# Altium schematic sheet 18.SchDoc
size 297 x 209 mm
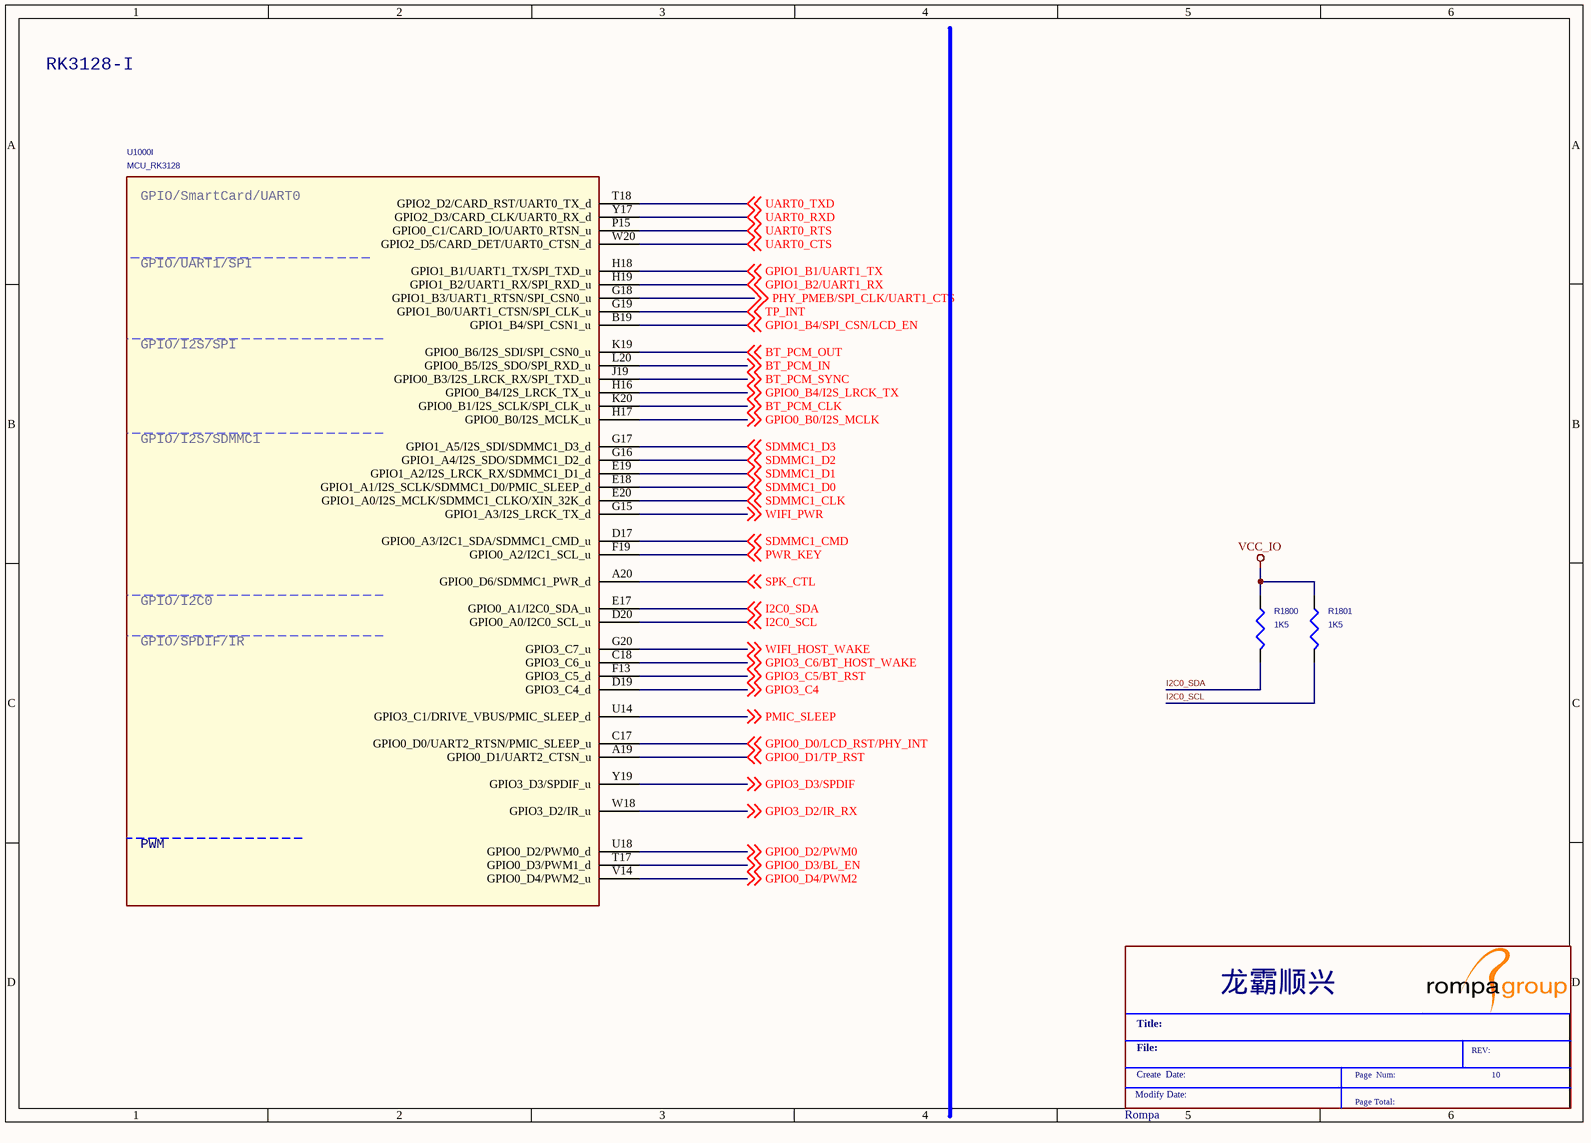
[diagram p0: 18.SchDoc]

## Parts
*  Rompa  Schematic Page Number: 10  (graphical)
R1800  1K5  [R0402]
R1801  1K5  [R0402]
U1000  MCU_RK3128  [BGA316-14X14-0.65]  (part I of 12)

## Nets
VCC_IO: R1800.1 R1801.1
BT_PCM_CLK: U1000.K20(GPIO0_B1/I2S_SCLK/SPI_CLK_u) ; off-sheet BT_PCM_CLK
BT_PCM_IN: U1000.L20(GPIO0_B5/I2S_SDO/SPI_RXD_u) ; off-sheet BT_PCM_IN
BT_PCM_OUT: U1000.K19(GPIO0_B6/I2S_SDI/SPI_CSN0_u) ; off-sheet BT_PCM_OUT
BT_PCM_SYNC: U1000.J19(GPIO0_B3/I2S_LRCK_RX/SPI_TXD_u) ; off-sheet BT_PCM_SYNC
GPIO0_B0/I2S_MCLK: U1000.H17(GPIO0_B0/I2S_MCLK_u) ; off-sheet GPIO0_B0/I2S_MCLK
GPIO0_B4/I2S_LRCK_TX: U1000.H16(GPIO0_B4/I2S_LRCK_TX_u) ; off-sheet GPIO0_B4/I2S_LRCK_TX
GPIO0_D0/LCD_RST/PHY_INT: U1000.C17(GPIO0_D0/UART2_RTSN/PMIC_SLEEP_u) ; off-sheet GPIO0_D0/LCD_RST/PHY_INT
GPIO0_D1/TP_RST: U1000.A19(GPIO0_D1/UART2_CTSN_u) ; off-sheet GPIO0_D1/TP_RST
GPIO0_D2/PWM0: U1000.U18(GPIO0_D2/PWM0_d) ; off-sheet GPIO0_D2/PWM0
GPIO0_D3/BL_EN: U1000.T17(GPIO0_D3/PWM1_d) ; off-sheet GPIO0_D3/BL_EN
GPIO0_D4/PWM2: U1000.V14(GPIO0_D4/PWM2_u) ; off-sheet GPIO0_D4/PWM2
GPIO1_B1/UART1_TX: U1000.H18(GPIO1_B1/UART1_TX/SPI_TXD_u) ; off-sheet GPIO1_B1/UART1_TX
GPIO1_B2/UART1_RX: U1000.H19(GPIO1_B2/UART1_RX/SPI_RXD_u) ; off-sheet GPIO1_B2/UART1_RX
GPIO1_B4/SPI_CSN/LCD_EN: U1000.B19(GPIO1_B4/SPI_CSN1_u) ; off-sheet GPIO1_B4/SPI_CSN/LCD_EN
GPIO3_C4: U1000.D19(GPIO3_C4_d) ; off-sheet GPIO3_C4
GPIO3_C5/BT_RST: U1000.F13(GPIO3_C5_d) ; off-sheet GPIO3_C5/BT_RST
GPIO3_C6/BT_HOST_WAKE: U1000.C18(GPIO3_C6_u) ; off-sheet GPIO3_C6/BT_HOST_WAKE
GPIO3_D2/IR_RX: U1000.W18(GPIO3_D2/IR_u) ; off-sheet GPIO3_D2/IR_RX
GPIO3_D3/SPDIF: U1000.Y19(GPIO3_D3/SPDIF_u) ; off-sheet GPIO3_D3/SPDIF
I2C0_SCL: R1801.2 U1000.D20(GPIO0_A0/I2C0_SCL_u) ; off-sheet I2C0_SCL
I2C0_SDA: R1800.2 U1000.E17(GPIO0_A1/I2C0_SDA_u) ; off-sheet I2C0_SDA
PHY_PMEB/SPI_CLK/UART1_CTS: U1000.G18(GPIO1_B3/UART1_RTSN/SPI_CSN0_u) ; off-sheet PHY_PMEB/SPI_CLK/UART1_CTS
PMIC_SLEEP: U1000.U14(GPIO3_C1/DRIVE_VBUS/PMIC_SLEEP_d) ; off-sheet PMIC_SLEEP
PWR_KEY: U1000.F19(GPIO0_A2/I2C1_SCL_u) ; off-sheet PWR_KEY
SDMMC1_CLK: U1000.E20(GPIO1_A0/I2S_MCLK/SDMMC1_CLKO/XIN_32K_d) ; off-sheet SDMMC1_CLK
SDMMC1_CMD: U1000.D17(GPIO0_A3/I2C1_SDA/SDMMC1_CMD_u) ; off-sheet SDMMC1_CMD
SDMMC1_D0: U1000.E18(GPIO1_A1/I2S_SCLK/SDMMC1_D0/PMIC_SLEEP_d) ; off-sheet SDMMC1_D0
SDMMC1_D1: U1000.E19(GPIO1_A2/I2S_LRCK_RX/SDMMC1_D1_d) ; off-sheet SDMMC1_D1
SDMMC1_D2: U1000.G16(GPIO1_A4/I2S_SDO/SDMMC1_D2_d) ; off-sheet SDMMC1_D2
SDMMC1_D3: U1000.G17(GPIO1_A5/I2S_SDI/SDMMC1_D3_d) ; off-sheet SDMMC1_D3
SPK_CTL: U1000.A20(GPIO0_D6/SDMMC1_PWR_d) ; off-sheet SPK_CTL
TP_INT: U1000.G19(GPIO1_B0/UART1_CTSN/SPI_CLK_u) ; off-sheet TP_INT
UART0_CTS: U1000.W20(GPIO2_D5/CARD_DET/UART0_CTSN_d) ; off-sheet UART0_CTS
UART0_RTS: U1000.P15(GPIO0_C1/CARD_IO/UART0_RTSN_u) ; off-sheet UART0_RTS
UART0_RXD: U1000.Y17(GPIO2_D3/CARD_CLK/UART0_RX_d) ; off-sheet UART0_RXD
UART0_TXD: U1000.T18(GPIO2_D2/CARD_RST/UART0_TX_d) ; off-sheet UART0_TXD
WIFI_HOST_WAKE: U1000.G20(GPIO3_C7_u) ; off-sheet WIFI_HOST_WAKE
WIFI_PWR: U1000.G15(GPIO1_A3/I2S_LRCK_TX_d) ; off-sheet WIFI_PWR

## Notes on the sheet
- RK3128-I
- (in symbol MCU_RK3128, part I) GPIO/SmartCard/UART0; GPIO/UART1/SPI; GPIO/I2S/SPI; GPIO/I2S/SDMMC1; GPIO/I2C0; GPIO/SPDIF/IR; PWM
- (in symbol Rompa) 龙霸顺兴; Title:; File:; REV:; Create  Date:; Page  Num:; Modify Date:; Page Total:

## Library data of the parts
R1800 R1801 = RES 1B: ROHS CHIP RES 4.7K 1/16W 5%